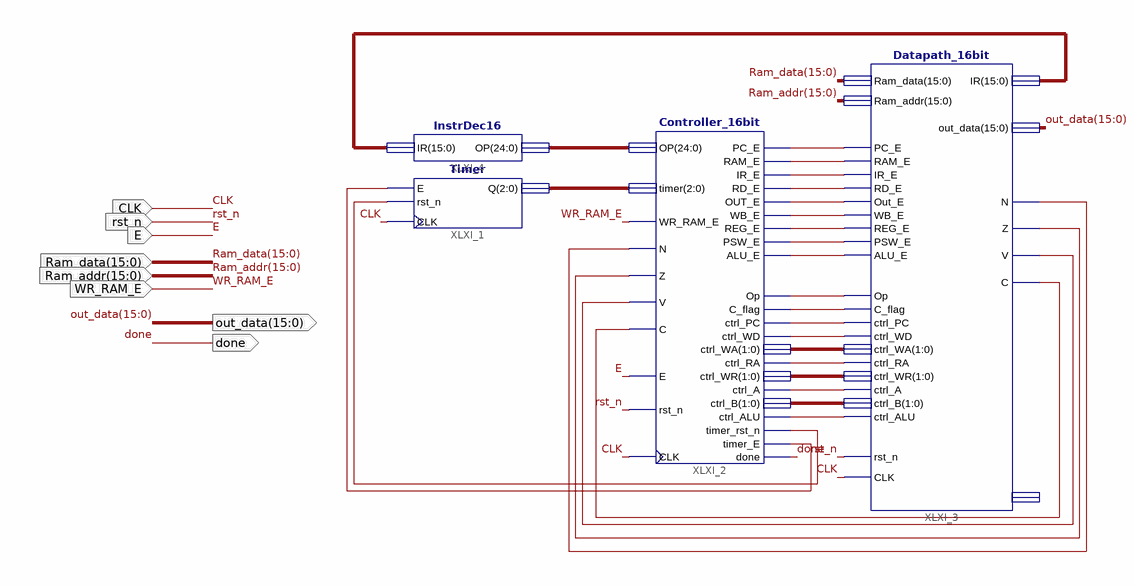
[diagram p0: schematic sheet 1]
// Xilinx ISE schematic RISC_16bit.sch (virtex6) as structural Verilog: 4 symbols, 8 ports
module RISC_16bit (
  input  rst_n,
  input  CLK,
  input  E,
  input  [15:0] Ram_addr,
  input  [15:0] Ram_data,
  input  WR_RAM_E,
  output [15:0] out_data,
  output done
);

  wire XLXN_1, XLXN_3, XLXN_5, XLXN_9, XLXN_10, XLXN_11, XLXN_12, XLXN_13, XLXN_14, XLXN_15, XLXN_16,
       XLXN_17, XLXN_18, XLXN_19, XLXN_34, XLXN_35, XLXN_37, XLXN_41, XLXN_42, XLXN_43, XLXN_44, XLXN_45;
  wire [1:0] XLXN_2, XLXN_4, XLXN_6;
  wire [2:0] XLXN_22;
  wire [15:0] XLXN_38;
  wire [24:0] XLXN_20;

  Controller_16bit XLXI_2 (
    .Z(XLXN_35), .C(XLXN_45), .E(E), .N(XLXN_37), .V(XLXN_34), .rst_n(rst_n), .WR_RAM_E(WR_RAM_E),
    .timer(XLXN_22), .OP(XLXN_20), .Op(XLXN_10), .PC_E(XLXN_19), .RAM_E(XLXN_18), .RD_E(XLXN_16),
    .OUT_E(XLXN_15), .WB_E(XLXN_14), .REG_E(XLXN_13), .PSW_E(XLXN_12), .ALU_E(XLXN_11), .C_flag(XLXN_9),
    .ctrl_PC(XLXN_44), .ctrl_WD(XLXN_43), .ctrl_RA(XLXN_5), .ctrl_A(XLXN_3), .ctrl_ALU(XLXN_1),
    .IR_E(XLXN_17), .timer_rst_n(XLXN_41), .done(done), .ctrl_WA(XLXN_6), .ctrl_WR(XLXN_4), .ctrl_B(XLXN_2),
    .timer_E(XLXN_42), .CLK(CLK));
  Timer XLXI_1 (.E(XLXN_42), .rst_n(XLXN_41), .Q(XLXN_22), .CLK(CLK));
  InstrDec16 XLXI_4 (.IR(XLXN_38), .OP(XLXN_20));
  Datapath_16bit XLXI_3 (
    .Ram_data(Ram_data), .ctrl_WD(XLXN_43), .Ram_addr(Ram_addr), .ctrl_PC(XLXN_44), .PC_E(XLXN_19),
    .WB_E(XLXN_14), .CLK(CLK), .IR_E(XLXN_17), .ctrl_WA(XLXN_6), .RAM_E(XLXN_18), .C_flag(XLXN_9),
    .Op(XLXN_10), .rst_n(rst_n), .Out_E(XLXN_15), .REG_E(XLXN_13), .PSW_E(XLXN_12), .ctrl_WR(XLXN_4),
    .ctrl_A(XLXN_3), .ctrl_B(XLXN_2), .ALU_E(XLXN_11), .ctrl_ALU(XLXN_1), .ctrl_RA(XLXN_5), .RD_E(XLXN_16),
    .IR(XLXN_38), .out_data(out_data), .N(XLXN_37), .Z(XLXN_35), .V(XLXN_34), .C(XLXN_45));  // open: RD
endmodule
